# EAGLE design HoneyPI_Platine 2.0 (EAGLE 9.6.1)
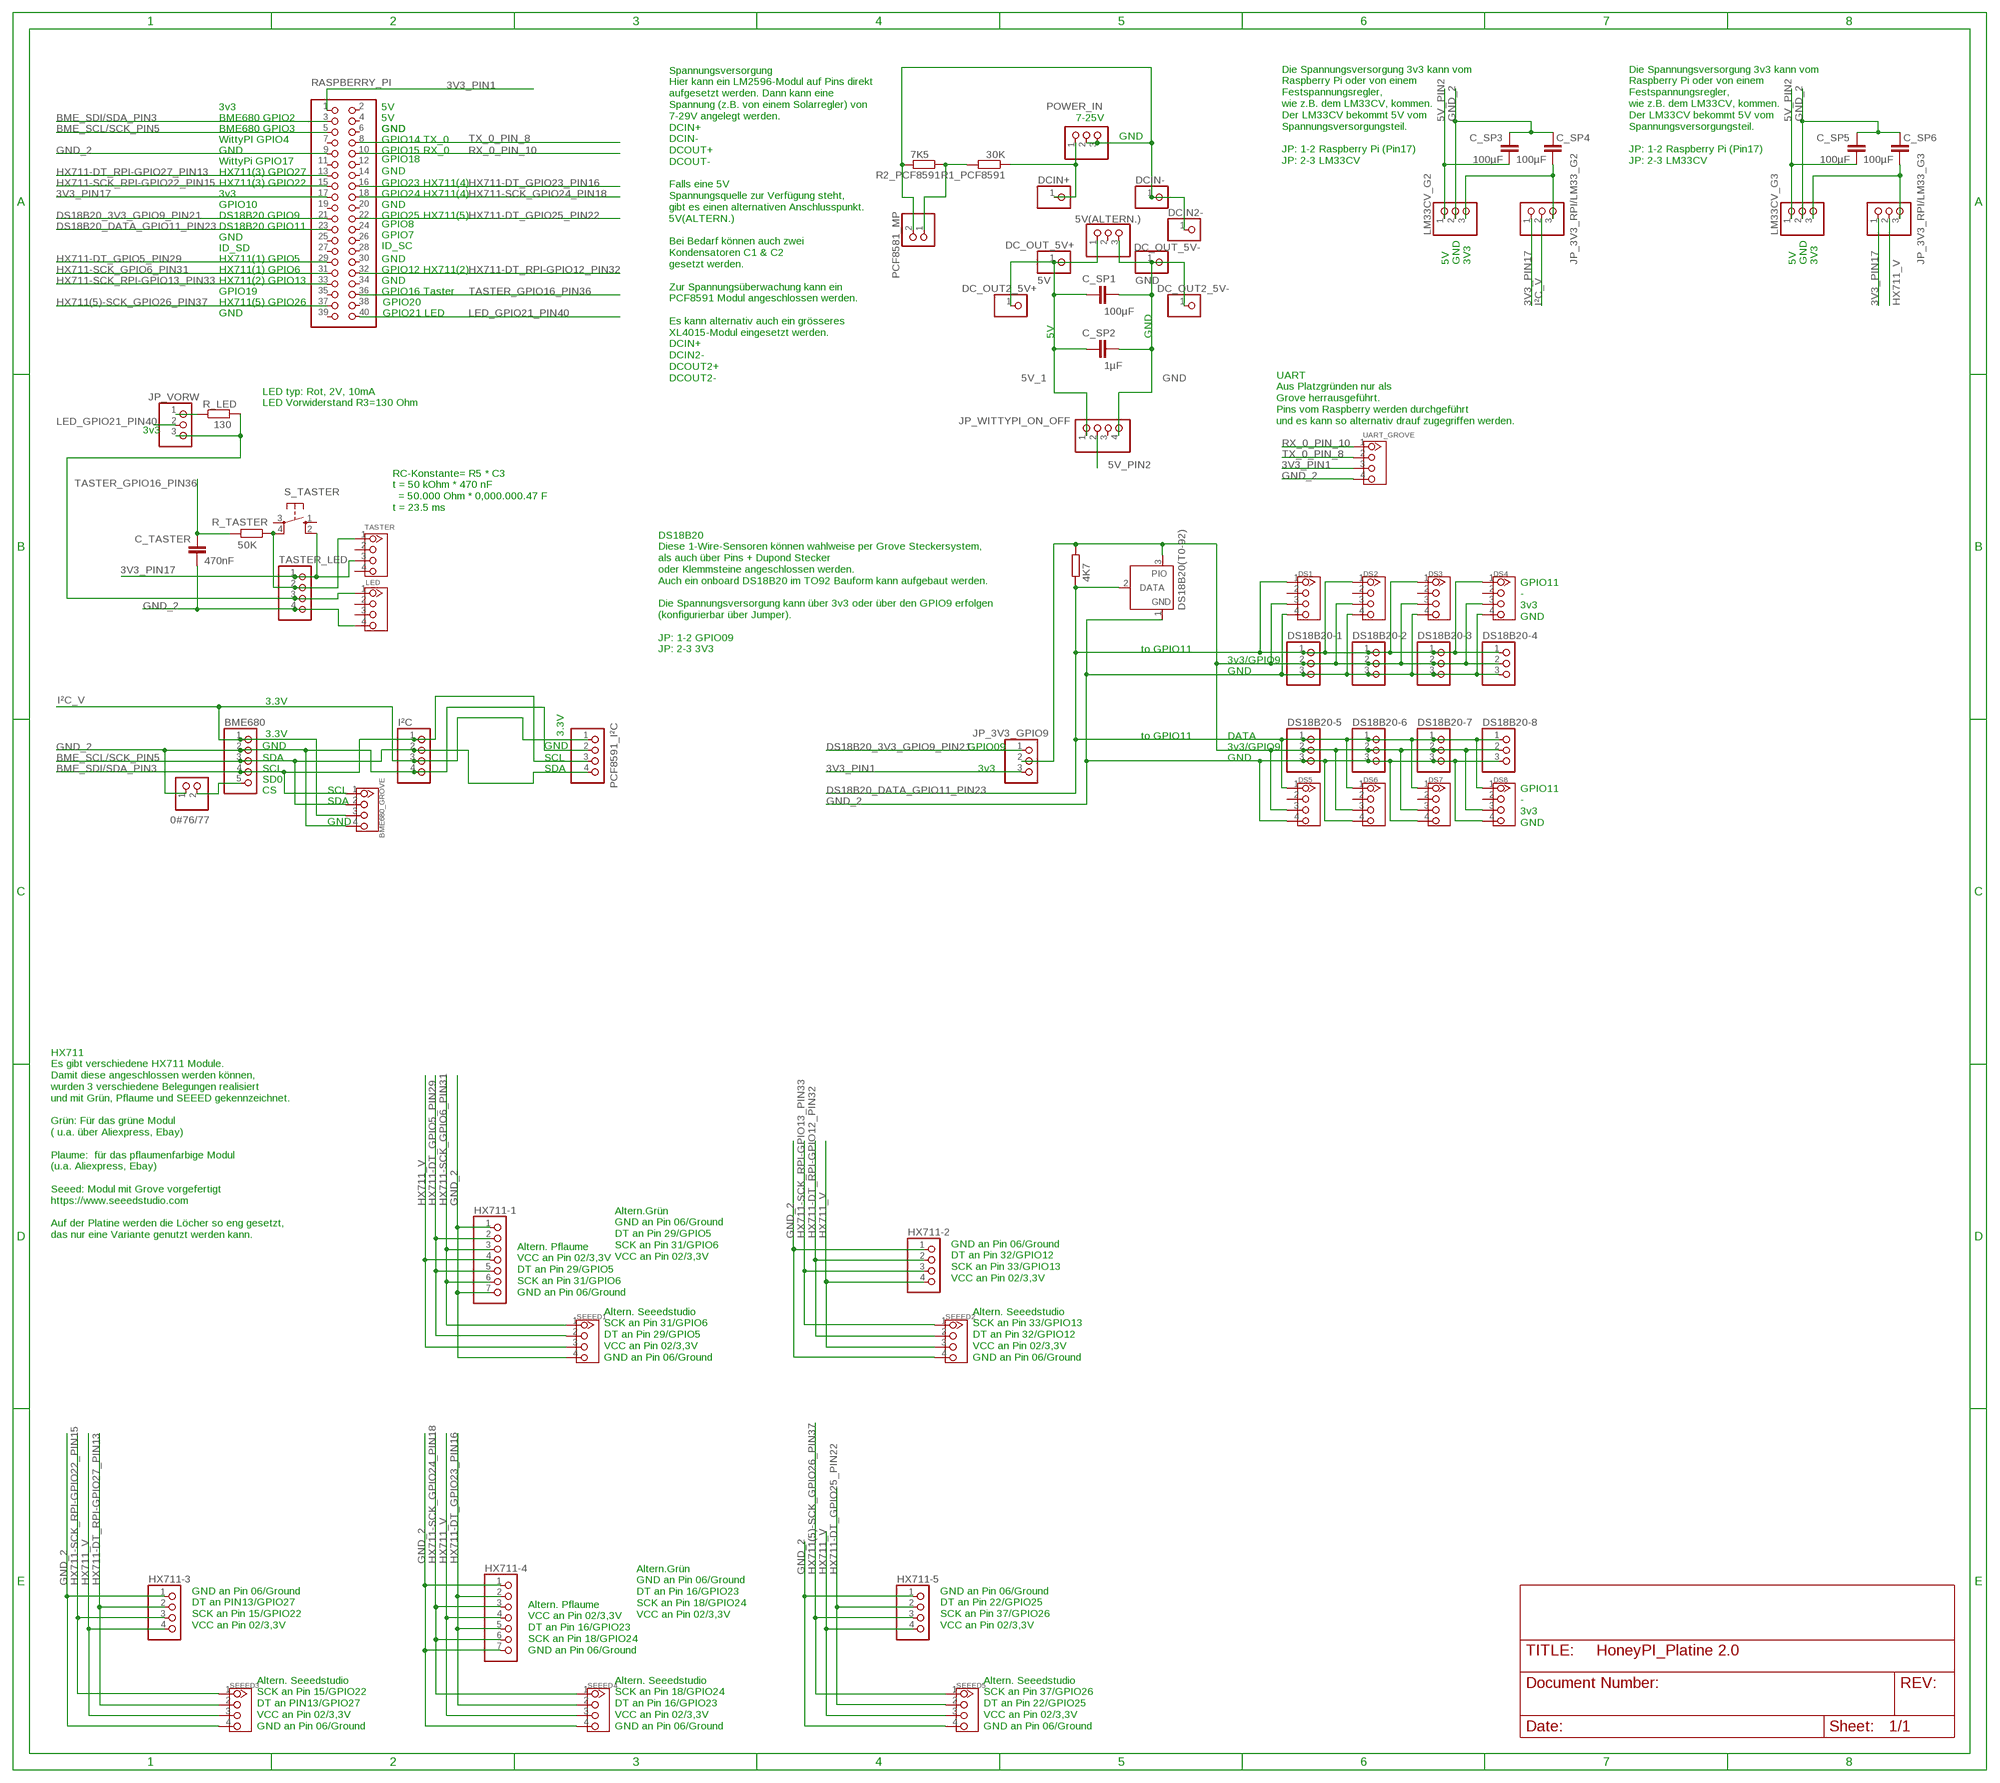
[diagram p0: schematic, sheet 1]

## Parts
0#76/77  PINHD-1X2  [1X02]
5V(ALTERN.)  PINHD-1X3  [1X03]
BME680  PINHD-1X5  [1X05]
BME680_GROVE  TWIG-4P-2.0-2.0  [4P-2.0]
C_SP1  100µF  C2,5-3  [C2.5-3]
C_SP2  1µF  C2,5-3  [C2.5-3]
C_SP3  100µF  C2,5-3  [C2.5-3]
C_SP4  100µF  C2,5-3  [C2.5-3]
C_SP5  100µF  C2,5-3  [C2.5-3]
C_SP6  100µF  C2,5-3  [C2.5-3]
C_TASTER  470nF  C2,5-3  [C2.5-3]
DC_OUT2_5V+  PINHD-1X1  [1X01]
DC_OUT2_5V-  PINHD-1X1  [1X01]
DC_OUT_5V+  5V  PINHD-1X1  [1X01]
DC_OUT_5V-  GND  PINHD-1X1  [1X01]
DCIN2-  PINHD-1X1  [1X01]
DCIN+  PINHD-1X1  [1X01]
DCIN-  PINHD-1X1  [1X01]
DS1  TWIG-4P-2.0-2.0  [4P-2.0]
DS2  TWIG-4P-2.0-2.0  [4P-2.0]
DS3  TWIG-4P-2.0-2.0  [4P-2.0]
DS4  TWIG-4P-2.0-2.0  [4P-2.0]
DS5  TWIG-4P-2.0-2.0  [4P-2.0]
DS6  TWIG-4P-2.0-2.0  [4P-2.0]
DS7  TWIG-4P-2.0-2.0  [4P-2.0]
DS8  TWIG-4P-2.0-2.0  [4P-2.0]
DS18B20(T0-92)  DS18b20  DS2405  [TO92-]
DS18B20-1  PINHD-1X3  [1X03]
DS18B20-2  PINHD-1X3  [1X03]
DS18B20-3  PINHD-1X3  [1X03]
DS18B20-4  PINHD-1X3  [1X03]
DS18B20-5  PINHD-1X3  [1X03]
DS18B20-6  PINHD-1X3  [1X03]
DS18B20-7  PINHD-1X3  [1X03]
DS18B20-8  PINHD-1X3  [1X03]
HX711-1  PINHD-1X7  [1X07]
HX711-2  PINHD-1X4  [1X04]
HX711-3  PINHD-1X4  [1X04]
HX711-4  PINHD-1X7  [1X07]
HX711-5  PINHD-1X4  [1X04]
I²C  PINHD-1X4  [1X04]
JP_3V3_GPIO9  PINHD-1X3  [1X03]
JP_3V3_RPI/LM33_G2  PINHD-1X3  [1X03]
JP_3V3_RPI/LM33_G3  PINHD-1X3  [1X03]
JP_VORW  PINHD-1X3  [1X03]
JP_WITTYPI_ON_OFF  PINHD-1X4  [1X04]
LED  TWIG-4P-2.0-2.0  [4P-2.0]
LM33CV_G2  PINHD-1X3  [1X03]
LM33CV_G3  PINHD-1X3  [1X03]
PCF8581_MP  PINHD-1X2  [1X02]
PCF8591_I²C  PINHD-1X4  [1X04]
POWER_IN  PINHD-1X3  [1X03]
R1_PCF8591  30K  R-EU_0204/7  [0204/7]
R2_PCF8591  7K5  R-EU_0204/7  [0204/7]
R_DS18B20  4K7  R-EU_0204/7  [0204/7]
R_LED  130  R-EU_0204/7  [0204/7]
R_TASTER  50K  R-EU_0204/7  [0204/7]
RASPBERRY_PI  PINHD-2X20  [2X20]
S_TASTER  10-XX  [B3F-10XX]
SEEED1  TWIG-4P-2.0-2.0  [4P-2.0]
SEEED2  TWIG-4P-2.0-2.0  [4P-2.0]
SEEED3  TWIG-4P-2.0-2.0  [4P-2.0]
SEEED4  TWIG-4P-2.0-2.0  [4P-2.0]
SEEED5  TWIG-4P-2.0-2.0  [4P-2.0]
TASTER  TWIG-4P-2.0-2.0  [4P-2.0]
TASTER_LED  PINHD-1X4  [1X04]
UART_GROVE  TWIG-4P-2.0-2.0  [4P-2.0]

## Nets
3V3 [Supply3v3]: DS1.3 DS2.3 DS3.3 DS4.3 DS5.3 DS6.3 DS7.3 DS8.3 DS18B20(T0-92).3(PIO) DS18B20-1.2 DS18B20-2.2 DS18B20-3.2 DS18B20-4.2 DS18B20-5.2 DS18B20-6.2 DS18B20-7.2 DS18B20-8.2 JP_3V3_GPIO9.2 R_DS18B20.2
3V3_PIN1 [Supply3v3]: JP_3V3_GPIO9.3 RASPBERRY_PI.1 UART_GROVE.3
3V3_PIN17 [Supply3v3]: JP_3V3_RPI/LM33_G2.1 JP_3V3_RPI/LM33_G3.1 RASPBERRY_PI.17 S_TASTER.2(S1) TASTER.3 TASTER_LED.1
5V_1 [Supply5v]: 5V(ALTERN.).1 C_SP1.1 C_SP2.1 DC_OUT2_5V+.1 DC_OUT_5V+.1 JP_WITTYPI_ON_OFF.1
5V_PIN2 [Supply5v]: C_SP3.1 C_SP5.1 JP_WITTYPI_ON_OFF.2 LM33CV_G2.1 LM33CV_G3.1
BME_SCL/SCK_PIN5: BME680.3 BME680_GROVE.2 I²C.2 PCF8591_I²C.4 RASPBERRY_PI.5
BME_SDI/SDA_PIN3: BME680.4 BME680_GROVE.1 I²C.1 PCF8591_I²C.3 RASPBERRY_PI.3
DS18B20_3V3_GPIO9_PIN21 [Supply3v3]: JP_3V3_GPIO9.1 RASPBERRY_PI.21
DS18B20_DATA_GPIO11_PIN23: DS1.1 DS2.1 DS3.1 DS4.1 DS5.1 DS6.1 DS7.1 DS8.1 DS18B20(T0-92).2(DATA) DS18B20-1.1 DS18B20-2.1 DS18B20-3.1 DS18B20-4.1 DS18B20-5.1 DS18B20-6.1 DS18B20-7.1 DS18B20-8.1 R_DS18B20.1 RASPBERRY_PI.23
GND [Supply3v3]: 5V(ALTERN.).3 C_SP1.2 C_SP2.2 DC_OUT2_5V-.1 DC_OUT_5V-.1 JP_WITTYPI_ON_OFF.4
GND_2 [Supply3v3]: 0#76/77.1 BME680.2 BME680_GROVE.4 C_SP3.2 C_SP4.2 C_SP5.2 C_SP6.2 C_TASTER.1 DS1.4 DS2.4 DS3.4 DS4.4 DS5.4 DS6.4 DS7.4 DS8.4 DS18B20(T0-92).1(GND) DS18B20-1.3 DS18B20-2.3 DS18B20-3.3 DS18B20-4.3 DS18B20-5.3 DS18B20-6.3 DS18B20-7.3 DS18B20-8.3 HX711-1.1 HX711-1.7 HX711-2.1 HX711-3.1 HX711-4.1 HX711-4.7 HX711-5.1 I²C.4 LED.4 LM33CV_G2.2 LM33CV_G3.2 PCF8591_I²C.2 RASPBERRY_PI.9 SEEED1.4 SEEED2.4 SEEED3.4 SEEED4.4 SEEED5.4 TASTER_LED.4 UART_GROVE.4
HX711(5)-SCK_GPIO26_PIN37: HX711-5.3 RASPBERRY_PI.37 SEEED5.1
HX711-DT_GPIO5_PIN29: HX711-1.2 HX711-1.5 RASPBERRY_PI.29 SEEED1.2
HX711-DT_GPIO23_PIN16: HX711-4.2 HX711-4.5 RASPBERRY_PI.16 SEEED4.2
HX711-DT_GPIO25_PIN22: HX711-5.2 RASPBERRY_PI.22 SEEED5.2
HX711-DT_RPI-GPIO12_PIN32: HX711-2.2 RASPBERRY_PI.32 SEEED2.2
HX711-DT_RPI-GPIO27_PIN13: HX711-3.2 RASPBERRY_PI.13 SEEED3.2
HX711-SCK_GPIO6_PIN31: HX711-1.3 HX711-1.6 RASPBERRY_PI.31 SEEED1.1
HX711-SCK_GPIO24_PIN18: HX711-4.3 HX711-4.6 RASPBERRY_PI.18 SEEED4.1
HX711-SCK_RPI-GPIO13_PIN33: HX711-2.3 RASPBERRY_PI.33 SEEED2.1
HX711-SCK_RPI-GPIO22_PIN15: HX711-3.3 RASPBERRY_PI.15 SEEED3.1
HX711_V [Supply5v]: HX711-1.4 HX711-2.4 HX711-3.4 HX711-4.4 HX711-5.4 JP_3V3_RPI/LM33_G3.2 SEEED1.3 SEEED2.3 SEEED3.3 SEEED4.3 SEEED5.3
I²C_V [Supply3v3]: BME680.1 BME680_GROVE.3 I²C.3 JP_3V3_RPI/LM33_G2.2 PCF8591_I²C.1
LED_2: JP_VORW.3 LED.1 R_LED.2 TASTER_LED.3
LED_GPIO21_PIN40 [Supply3v3]: JP_VORW.2 RASPBERRY_PI.40
N$1: DCIN2-.1 DCIN-.1 PCF8581_MP.2 POWER_IN.2 POWER_IN.3 R2_PCF8591.2
N$2: C_SP4.1 JP_3V3_RPI/LM33_G2.3 LM33CV_G2.3
N$3: R_TASTER.1 S_TASTER.4(P1) TASTER.1 TASTER_LED.2
N$4: C_SP6.1 JP_3V3_RPI/LM33_G3.3 LM33CV_G3.3
N$6: PCF8581_MP.1 R1_PCF8591.2 R2_PCF8591.1
N$8: 0#76/77.2 BME680.5
N$10: JP_VORW.1 R_LED.1
N$45 [Supply5v]: DCIN+.1 POWER_IN.1 R1_PCF8591.1
RX_0_PIN_10: RASPBERRY_PI.10 UART_GROVE.1
TASTER_GPIO16_PIN36: C_TASTER.2 R_TASTER.2 RASPBERRY_PI.36
TX_0_PIN_8: RASPBERRY_PI.8 UART_GROVE.2
Unconnected: 5V(ALTERN.).2 DS1.2 DS2.2 DS3.2 DS4.2 DS5.2 DS6.2 DS7.2 DS8.2 JP_WITTYPI_ON_OFF.3 LED.2 LED.3 RASPBERRY_PI.2 RASPBERRY_PI.4 RASPBERRY_PI.6 RASPBERRY_PI.7 RASPBERRY_PI.11 RASPBERRY_PI.12 RASPBERRY_PI.14 RASPBERRY_PI.19 RASPBERRY_PI.20 RASPBERRY_PI.24 RASPBERRY_PI.25 RASPBERRY_PI.26 RASPBERRY_PI.27 RASPBERRY_PI.28 RASPBERRY_PI.30 RASPBERRY_PI.34 RASPBERRY_PI.35 RASPBERRY_PI.38 RASPBERRY_PI.39 S_TASTER.1(S) S_TASTER.3(P) TASTER.2 TASTER.4

## Notes on the sheet
- 3v3 | 5V
- BME680 GPIO2 | 5V | 7-25V
- BME680 GPIO3 | GND | GND
- GND
- WittyPI GPIO4 | GPIO14 TX_0
- GND | GPIO15 RX_0
- WittyPi GPIO17 | GPIO18
- HX711(3) GPIO27 | GND
- Die Spannungsversorgung 3v3 kann vom
  Raspberry Pi oder von einem 
  Festspannungsregler, 
  wie z.B. dem LM33CV, kommen.
  Der LM33CV bekommt 5V vom
  Spannungsversorgungsteil.
  
  JP: 1-2 Raspberry Pi (Pin17)
  JP: 2-3 LM33CV
- Die Spannungsversorgung 3v3 kann vom
  Raspberry Pi oder von einem 
  Festspannungsregler, 
  wie z.B. dem LM33CV, kommen.
  Der LM33CV bekommt 5V vom
  Spannungsversorgungsteil.
  
  JP: 1-2 Raspberry Pi (Pin17)
  JP: 2-3 LM33CV
- HX711(3) GPIO22 | GPIO23 HX711(4)
- 3v3 | GPIO24 HX711(4)
- GPIO10 | GND
- DS18B20 GPIO9 | GPIO25 HX711(5)
- DS18B20 GPIO11 | GPIO8
- GND | GPIO7
- ID_SD | ID_SC
- HX711(1) GPIO5 | GND | 5V | GND | 3V3 | 5V | GND | 3V3
- HX711(1) GPIO6 | GPIO12 HX711(2)
- HX711(2) GPIO13 | GND
- GPIO19 | GPIO16 Taster
- HX711(5) GPIO26 | GPIO20
- GND | GPIO21 LED
- 5V | GND
- Spannungsversorgung
  Hier kann ein LM2596-Modul auf Pins direkt
  aufgesetzt werden. Dann kann eine
  Spannung (z.B. von einem Solarregler) von
  7-29V angelegt werden.
  DCIN+
  DCIN-
  DCOUT+
  DCOUT-
  
  Falls eine 5V
  Spannungsquelle zur Verfügung steht,
  gibt es einen alternativen Anschlusspunkt.
  5V(ALTERN.)
  
  Bei Bedarf können auch zwei
  Kondensatoren C1 & C2
  gesetzt werden.    
  
  Zur Spannungsüberwachung kann ein
  PCF8591 Modul angeschlossen werden. 
  
  Es kann alternativ auch ein grösseres
  XL4015-Modul eingesetzt werden. 
  DCIN+
  DCIN2-
  DCOUT2+
  DCOUT2-
- LED typ: Rot, 2V, 10mA
  LED Vorwiderstand R3=130 Ohm
- 3v3
- UART
  Aus Platzgründen nur als
  Grove herrausgeführt. 
  Pins vom Raspberry werden durchgeführt
  und es kann so alternativ drauf zugegriffen werden.
- RC-Konstante= R5 * C3
  t = 50 kOhm * 470 nF    
    = 50.000 Ohm * 0,000.000.47 F
  t = 23.5 ms
- GPIO11
  -
  3v3
  GND
- DS18B20
  Diese 1-Wire-Sensoren können wahlweise per Grove Steckersystem,
  als auch über Pins + Dupond Stecker
  oder Klemmsteine angeschlossen werden.
  Auch ein onboard DS18B20 im TO92 Bauform kann aufgebaut werden. 
  
  Die Spannungsversorgung kann über 3v3 oder über den GPIO9 erfolgen
  (konfigurierbar über Jumper).
  
  JP: 1-2 GPIO09
  JP: 2-3 3V3
- to GPIO11
- 3v3/GPIO9
- GND
- 3.3V
- 3.3V | 3.3V
- to GPIO11 | DATA
- GND | GND | GPIO09 | 3v3/GPIO9
- SDA | SCL | GND
- SCL | SDA | 3v3
- SD0
- CS | SCL
- SDA
- GND
- GPIO11
  -
  3v3
  GND
- HX711
  Es gibt verschiedene HX711 Module.
  Damit diese angeschlossen werden können,
  wurden 3 verschiedene Belegungen realisiert
  und mit Grün, Pflaume und SEEED gekennzeichnet.
  
  Grün: Für das grüne Modul 
  ( u.a. über Aliexpress, Ebay)
  
  Plaume:  für das pflaumenfarbige Modul 
  (u.a. Aliexpress, Ebay) 
  
  Seeed: Modul mit Grove vorgefertigt
  https://www.seeedstudio.com
  
  Auf der Platine werden die Löcher so eng gesetzt,
  das nur eine Variante genutzt werden kann.
- Altern.Grün
  GND an Pin 06/Ground
  DT an Pin 29/GPIO5
  SCK an Pin 31/GPIO6
  VCC an Pin 02/3,3V
- GND an Pin 06/Ground
  DT an Pin 32/GPIO12
  SCK an Pin 33/GPIO13
  VCC an Pin 02/3,3V
- Altern. Pflaume
  VCC an Pin 02/3,3V
  DT an Pin 29/GPIO5
  SCK an Pin 31/GPIO6
  GND an Pin 06/Ground
- Altern. Seeedstudio
  SCK an Pin 31/GPIO6
  DT an Pin 29/GPIO5
  VCC an Pin 02/3,3V
  GND an Pin 06/Ground
- Altern. Seeedstudio
  SCK an Pin 33/GPIO13
  DT an Pin 32/GPIO12
  VCC an Pin 02/3,3V
  GND an Pin 06/Ground
- Altern.Grün
  GND an Pin 06/Ground
  DT an Pin 16/GPIO23
  SCK an Pin 18/GPIO24
  VCC an Pin 02/3,3V
- GND an Pin 06/Ground
  DT an PIN13/GPIO27
  SCK an Pin 15/GPIO22
  VCC an Pin 02/3,3V
- GND an Pin 06/Ground
  DT an Pin 22/GPIO25
  SCK an Pin 37/GPIO26
  VCC an Pin 02/3,3V
- Altern. Pflaume
  VCC an Pin 02/3,3V
  DT an Pin 16/GPIO23
  SCK an Pin 18/GPIO24
  GND an Pin 06/Ground
- Altern. Seeedstudio
  SCK an Pin 15/GPIO22
  DT an PIN13/GPIO27
  VCC an Pin 02/3,3V
  GND an Pin 06/Ground
- Altern. Seeedstudio
  SCK an Pin 18/GPIO24
  DT an Pin 16/GPIO23
  VCC an Pin 02/3,3V
  GND an Pin 06/Ground
- Altern. Seeedstudio
  SCK an Pin 37/GPIO26
  DT an Pin 22/GPIO25
  VCC an Pin 02/3,3V
  GND an Pin 06/Ground

## Library data of the parts
0#76/77 PCF8581_MP = pinhead:PINHD-1X2: PIN HEADER
5V(ALTERN.) DS18B20-1-DS18B20-8 JP_3V3_GPIO9 JP_3V3_RPI/LM33_G2 JP_3V3_RPI/LM33_G3 JP_VORW LM33CV_G2 LM33CV_G3 POWER_IN = pinhead:PINHD-1X3: PIN HEADER
BME680 = pinhead:PINHD-1X5: PIN HEADER
BME680_GROVE DS1-DS8 LED SEEED1-SEEED5 TASTER UART_GROVE = Connector:TWIG-4P-2.0
C_SP1-C_SP6 C_TASTER = capacitor-wima:C: CAPACITOR naming: grid - package width
DC_OUT2_5V+ DC_OUT2_5V- DC_OUT_5V+ DC_OUT_5V- DCIN2- DCIN+ DCIN- = pinhead:PINHD-1X1: PIN HEADER
DS18B20(T0-92) = maxim:DS2405: Addressable Switch DALLAS Semiconductor; MF: DALLAS SEMICONDUCTOR; MPN: DS2405; OC_FARNELL: 1188025; OC_NEWARK: 06F4645
HX711-1 HX711-4 = pinhead:PINHD-1X7: PIN HEADER
HX711-2 HX711-3 HX711-5 I²C JP_WITTYPI_ON_OFF PCF8591_I²C TASTER_LED = pinhead:PINHD-1X4: PIN HEADER
R1_PCF8591 R2_PCF8591 R_DS18B20 R_LED R_TASTER = rcl:R-EU_: RESISTOR, European symbol; SPICEPREFIX: R
RASPBERRY_PI = pinhead:PINHD-2X20: PIN HEADER
S_TASTER = switch-omron:10-XX: OMRON SWITCH; MPN: B3F-1000; OC_FARNELL: 176432; OC_NEWARK: 36M3542

## Net classes
0 Signal: width 0.152 mm, clearance 0.305 mm
1 Supply3v3: width 0.203 mm, clearance 0.305 mm
2 Supply5v: width 0.406 mm, clearance 0.305 mm

## Board
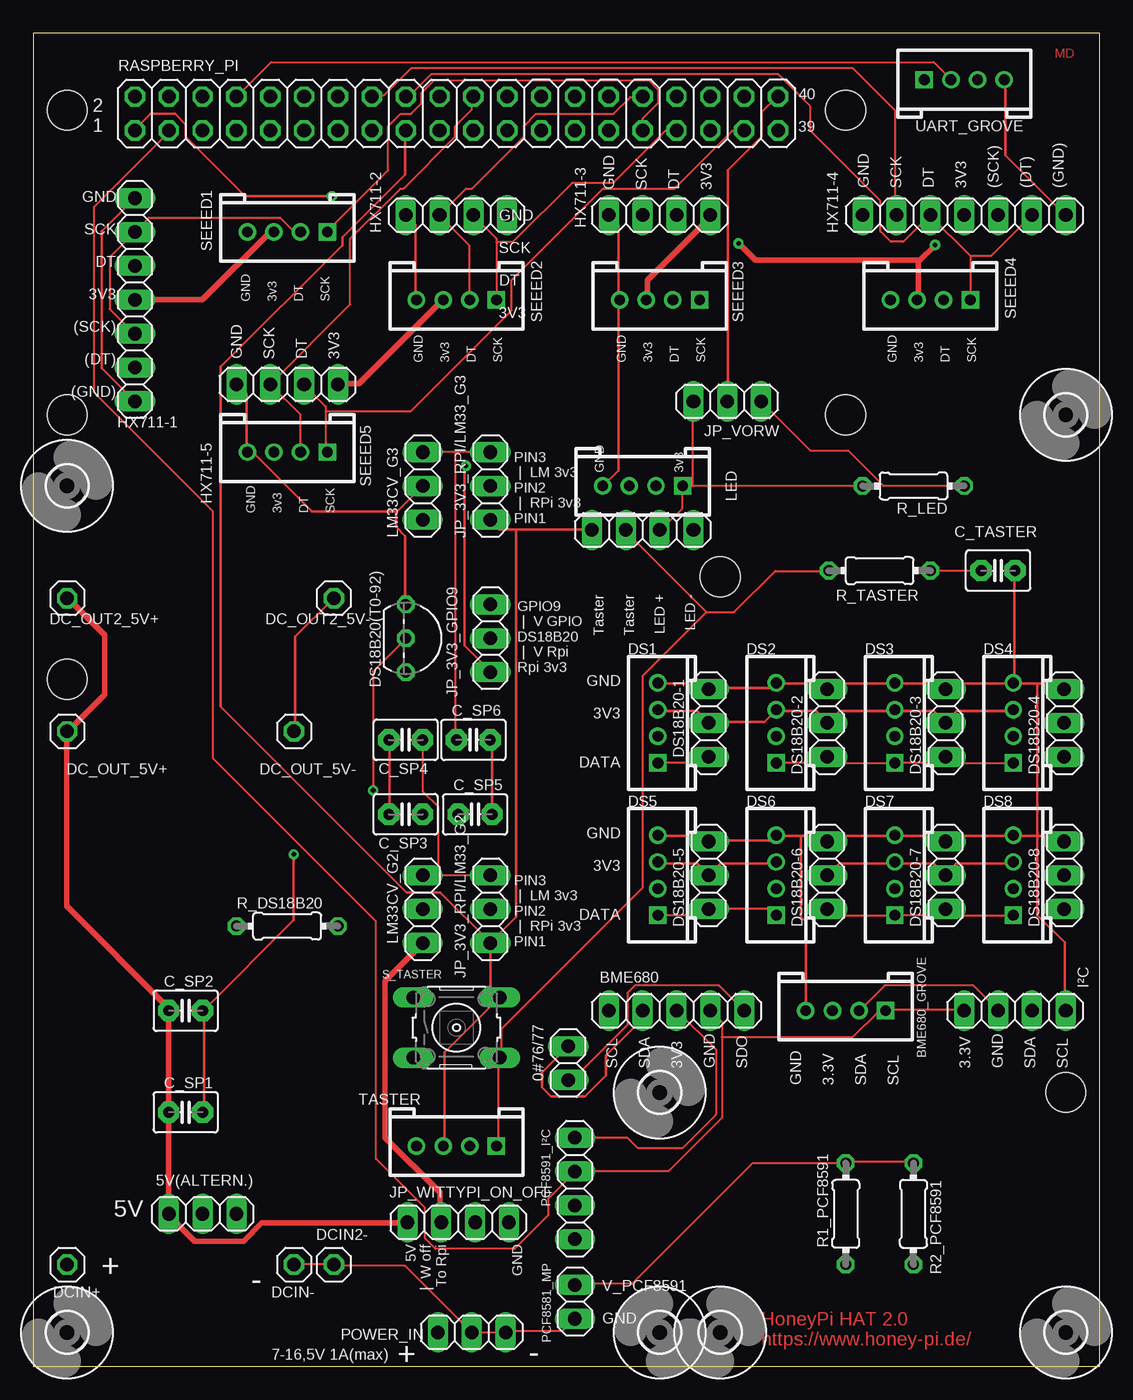
[diagram p1: board, top side]
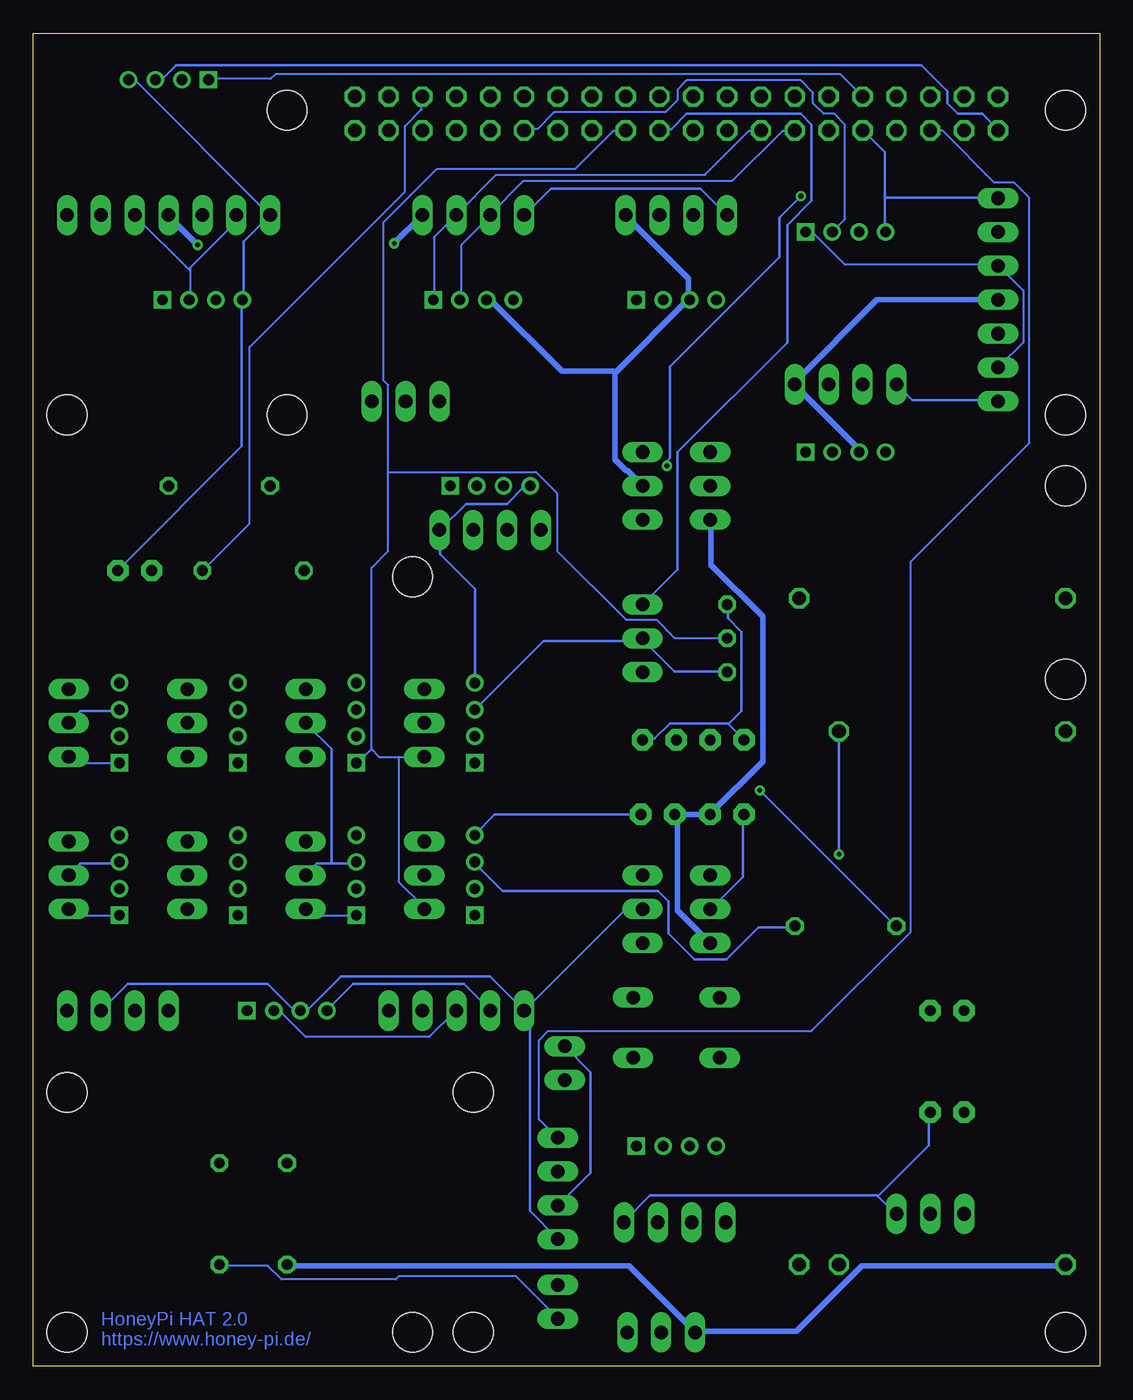
[diagram p2: board, bottom side, seen from below]

Size 80 x 100 mm. Coordinates in mm from the lower left corner, seen from the top.
Outline: 0,0 80,0 80,100 0,100 0,0
Copper layers (1*16): Top 0.035mm / dielectric 1.5mm / Bottom 0.035mm
Design rules "default *": minimum track width 6mil, minimum drill 0.35mm, track to track 6mil, track to pad 6mil, pad to pad 6mil, via to via 6mil, smd to smd 6mil, copper to edge 40mil, drill to drill 1mm, minimum pad ring 10mil, minimum via ring 8mil, stop-mask expansion 4mil, vias tented up to drill 0mil, thermal gap 10mil
Holes 3 mm at 2.54,94.23 2.54,71.37 60.96,94.23 60.96,71.37 77.47,20.54 51.54,59.23 2.54,51.54

### Footprints (pad centres in the part's own frame; a part is rotated, then mirrored left to right if it is on the bottom)
1X02 = drill 1.016 long: 1 -1.27,0; 2 1.27,0
1X03 = drill 1.016 long: 1 -2.54,0; 2 0,0; 3 2.54,0
1X05 = drill 1.016 long: 1 -5.08,0; 2 -2.54,0; 3 0,0; 4 2.54,0; 5 5.08,0
4P-2.0 = drill 0.8 pad 1.27 square: 1 -3,0 | drill 0.8 pad 1.27: 2 -1,0; 3 1,0; 4 3,0
C2.5-3 = drill 0.813 pad 1.6 octagon: 1 -1.27,0; 2 1.27,0
1X01 = drill 1.016 octagon: 1 0,0
TO92- = drill 0.813 octagon: 1 -2.54,0; 2 0,0; 3 2.54,0
1X07 = drill 1.016 long: 1 -7.62,0; 2 -5.08,0; 3 -2.54,0; 4 0,0; 5 2.54,0; 6 5.08,0; 7 7.62,0
1X04 = drill 1.016 long: 1 -3.81,0; 2 -1.27,0; 3 1.27,0; 4 3.81,0
0204/7 = drill 0.813 octagon: 1 -3.81,0; 2 3.81,0
2X20 = drill 1.016 octagon: 1 -24.13,-1.27; 2 -24.13,1.27; 3 -21.59,-1.27; 4 -21.59,1.27; 5 -19.05,-1.27; 6 -19.05,1.27; 7 -16.51,-1.27; 8 -16.51,1.27; 9 -13.97,-1.27; 10 -13.97,1.27; 11 -11.43,-1.27; 12 -11.43,1.27; 13 -8.89,-1.27; 14 -8.89,1.27; 15 -6.35,-1.27; 16 -6.35,1.27; 17 -3.81,-1.27; 18 -3.81,1.27; 19 -1.27,-1.27; 20 -1.27,1.27; 21 1.27,-1.27; 22 1.27,1.27; 23 3.81,-1.27; 24 3.81,1.27; 25 6.35,-1.27; 26 6.35,1.27; 27 8.89,-1.27; 28 8.89,1.27; 29 11.43,-1.27; 30 11.43,1.27; 31 13.97,-1.27; 32 13.97,1.27; 33 16.51,-1.27; 34 16.51,1.27; 35 19.05,-1.27; 36 19.05,1.27; 37 21.59,-1.27; 38 21.59,1.27; 39 24.13,-1.27; 40 24.13,1.27
B3F-10XX = drill 1.016 long: 1 -3.251,2.261; 2 3.251,2.261; 3 -3.251,-2.261; 4 3.251,-2.261
3,0 = hole 3: 0,0

### Placement (x,y rotation side)
0#76/77  40.13,22.73 270 top
5V(ALTERN.)  12.7,11.43 0 top
BME680  48.26,26.67 0 top
BME680_GROVE  60.96,26.67 180 top
C_SP1  11.43,19.05 0 top
C_SP2  11.43,26.67 0 top
C_SP3  27.94,41.4 180 top
C_SP4  27.94,46.99 180 top
C_SP5  33.15,41.4 0 top
C_SP6  33.02,46.99 0 top
C_TASTER  72.39,59.69 180 top
DC_OUT2_5V+  2.54,57.62 0 top
DC_OUT2_5V-  22.54,57.62 0 top
DC_OUT_5V+  2.54,47.62 0 top
DC_OUT_5V-  19.56,47.62 0 top
DCIN2-  22.54,7.62 0 top
DCIN+  2.54,7.62 0 top
DCIN-  19.56,7.62 0 top
DS1  46.86,48.26 90 top
DS2  55.75,48.26 90 top
DS3  64.64,48.26 90 top
DS4  73.53,48.26 90 top
DS5  46.86,36.83 90 top
DS6  55.75,36.83 90 top
DS7  64.64,36.83 90 top
DS8  73.53,36.83 90 top
DS18B20(T0-92)  27.94,54.61 270 top
DS18B20-1  50.67,48.26 90 top
DS18B20-2  59.56,48.26 90 top
DS18B20-3  68.45,48.26 90 top
DS18B20-4  77.34,48.26 90 top
DS18B20-5  50.67,36.83 90 top
DS18B20-6  59.56,36.83 90 top
DS18B20-7  68.45,36.83 90 top
DS18B20-8  77.34,36.83 90 top
HX711-1  7.62,80.01 270 top
HX711-2  31.75,86.36 0 top
HX711-3  46.99,86.36 0 top
HX711-4  69.85,86.36 0 top
HX711-5  19.05,73.66 0 top
I²C  73.66,26.67 0 top
JP_3V3_GPIO9  34.29,54.61 270 top
JP_3V3_RPI/LM33_G2  34.29,34.29 90 top
JP_3V3_RPI/LM33_G3  34.29,66.04 90 top
JP_VORW  52.07,72.39 180 top
JP_WITTYPI_ON_OFF  31.88,10.79 0 top
LED  45.72,66.04 180 top
LM33CV_G2  29.21,34.29 90 top
LM33CV_G3  29.21,66.04 90 top
PCF8581_MP  40.64,4.83 270 top
PCF8591_I²C  40.64,13.34 90 top
POWER_IN  32.89,2.54 0 top
R1_PCF8591  60.96,11.43 90 top
R2_PCF8591  66.04,11.43 270 top
R_DS18B20  19.05,33.02 0 top
R_LED  66.04,66.04 180 top
R_TASTER  63.5,59.69 0 top
RASPBERRY_PI  31.75,93.98 0 top
S_TASTER  31.75,25.4 0 top
SEEED1  19.05,85.09 180 top
SEEED2  31.75,80.01 180 top
SEEED3  46.99,80.01 180 top
SEEED4  67.31,80.01 180 top
SEEED5  19.05,68.58 180 top
TASTER  31.75,16.51 180 top
TASTER_LED  45.72,62.74 0 top
U$1  [3,0]  77.47,71.37 0 top
U$2  [3,0]  51.54,2.54 0 top
U$3  [3,0]  77.47,2.54 0 top
U$4  [3,0]  2.54,2.54 0 top
U$5  [3,0]  46.99,20.54 0 top
U$6  [3,0]  46.99,2.54 270 top
U$8  [3,0]  2.54,66.04 0 top
UART_GROVE  69.85,96.52 0 top

### Tracks (layer width: path | path; a pad name or v marks a point on that pad's centre or on a via)
3V3
  Top 0.203: DS1.3 46.86,49.15 49.84,49.15 50.63,48.35 DS18B20-1.2 50.75,48.35 54.86,48.35 55.66,49.15 DS2.3 55.78,49.15 58.75,49.15 59.55,48.35 DS18B20-2.2 59.66,48.35 60.47,49.15 64.58,49.15 DS3.3 64.69,49.15 67.55,49.15 68.35,48.35 DS18B20-3.2 68.47,48.35 69.27,49.15 73.5,49.15 DS4.3 | DS5.3 46.86,37.72 49.84,37.72 50.63,36.92 DS18B20-5.2 50.75,36.92 51.55,37.72 55.66,37.72 DS6.3 | DS18B20-6.2 59.66,36.92 60.47,37.72 64.58,37.72 DS7.3 64.69,37.72 67.55,37.72 68.35,36.92 DS18B20-7.2 68.47,36.92 69.27,37.72 73.5,37.72 DS8.3
  Bottom 0.203: DS18B20(T0-92).3 28,52.12 31.89,52.12 34.29,54.52 JP_3V3_GPIO9.2 34.29,54.41 41.72,54.41 DS1.3 | DS4.3 73.61,49.15 76.47,49.15 77.27,48.35 DS18B20-4.2 | DS8.3 73.61,37.72 76.47,37.72 77.27,36.92 DS18B20-8.2 | 57.61,37.72 58.75,37.72 59.55,36.92 DS18B20-6.2 | 57.61,37.72 55.78,37.72 DS6.3 | R_DS18B20.2 22.86,32.92 25.6,32.92 28,30.52 30.4,30.52 32.35,32.46 32.35,34.86 33.15,35.66 44.81,35.66 46.86,37.72 DS5.3 | 57.61,37.72 57.61,46.29 59.55,48.23 DS18B20-2.2
3V3_PIN1  (via drill 0.35)
  Top 0.203: v32.46,67.55 32.35,67.44 32.35,54.06 34.29,52.12 JP_3V3_GPIO9.3 | v22.4,87.78 15.89,87.78 11.43,92.24 11.43,93.15 10.63,93.95 8.8,93.95 7.66,92.81 RASPBERRY_PI.1
  Bottom 0.203: UART_GROVE.3 70.75,96.58 70.29,96.58 69.27,97.61 13.37,97.61 11.43,95.67 11.43,94.75 10.63,93.95 8.8,93.95 7.66,92.81 RASPBERRY_PI.1 | v32.46,67.55 32.46,67.89 32.23,68.12 32.23,74.98 24,83.21 24,86.18 v22.4,87.78
3V3_PIN17
  Top 0.203: 36.23,62.75 34.98,62.75 34.29,63.44 JP_3V3_RPI/LM33_G3.1 | 36.23,62.75 41.83,62.75 TASTER_LED.1 | TASTER.3 30.86,16.57 30.86,23.55 34.98,27.66 S_TASTER.2 34.86,27.66 34.29,28.23 JP_3V3_RPI/LM33_G2.1 34.29,31.77 | 34.29,31.77 30.52,35.55 28,35.55 14.06,49.49 14.06,74.98 23.2,84.12 23.2,84.7 27.89,89.38 27.89,92.7 RASPBERRY_PI.17 | 36.23,62.75 36.23,33.72 34.29,31.77
5V_1
  Top 0.406: DC_OUT2_5V+.1 2.63,57.61 5.37,54.86 5.37,50.41 2.63,47.66 DC_OUT_5V+.1 2.52,47.43 2.52,34.52 10.17,26.86 C_SP2.1 10.17,26.63 10.17,19.2 C_SP1.1 10.17,18.97 10.17,11.54 5V(ALTERN.).1 10.06,11.43 12.12,9.37 15.77,9.37 17.14,10.74 28,10.74 JP_WITTYPI_ON_OFF.1
5V_PIN2
  Top 0.406: JP_WITTYPI_ON_OFF.2 30.52,10.86 30.52,13.03 26.4,17.14 26.4,28.92 29.15,31.66 LM33CV_G2.1
  Bottom 0.406: LM33CV_G3.1 29.15,63.44 29.15,60.12 25.26,56.24 25.26,45.38 29.15,41.49 C_SP3.1 29.38,41.38 31.55,41.38 C_SP5.1 31.77,41.38 31.66,41.26 31.66,34.18 29.26,31.77 LM33CV_G2.1
BME_SCL/SCK_PIN5
  Top 0.152: BME680_GROVE.2 62.06,26.75 63.89,28.57 70.52,28.57 72.35,26.75 I²C.2 | PCF8591_I²C.4 44.58,17.14 45.38,16.34 48.69,16.34 51.21,18.86 51.21,23.77 48.35,26.63 BME680.3
  Bottom 0.152: RASPBERRY_PI.5 12.69,92.7 11.77,92.7 7.89,88.81 6.4,88.81 5.26,87.67 5.26,69.27 14.17,60.35 14.17,32.58 21.6,25.15 41.38,25.15 42.06,24.46 42.06,18.52 40.69,17.14 PCF8591_I²C.4 | BME680_GROVE.2 61.95,26.63 61.49,26.63 59.55,24.69 50.29,24.69 48.35,26.63 BME680.3
BME_SDI/SDA_PIN3
  Top 0.152: I²C.1 69.84,26.75 64.01,26.75 BME680_GROVE.1 63.89,26.63 63.44,26.63 61.49,24.69 51.66,24.69 | 51.66,24.69 51.66,25.83 50.86,26.63 BME680.4 | 51.66,24.69 51.66,18.63 47.66,14.63 40.69,14.63 PCF8591_I²C.3 40.58,14.52 38.63,12.57 38.63,11.32 36.12,8.8 30.18,8.8 29.38,9.6 29.38,11.89 25.72,15.54 25.72,33.38 13.49,45.61 13.49,64.12 4.57,73.04 4.57,86.98 10.06,92.47 10.06,92.7 RASPBERRY_PI.3
DS18B20_3V3_GPIO9_PIN21
  Bottom 0.203: JP_3V3_GPIO9.1 31.66,59.78 31.66,68.58 23.43,76.81 23.43,85.61 21.6,87.44 21.6,93.15 22.4,93.95 30.98,93.95 32.12,92.81 32.92,92.81 RASPBERRY_PI.21
DS18B20_DATA_GPIO11_PIN23  (via drill 0.35)
  Top 0.152: v25.49,43.2 25.49,52.12 27.89,54.52 DS18B20(T0-92).2 | DS5.1 50.18,33.83 50.63,34.29 DS18B20-5.1 55.21,34.29 55.66,33.83 DS6.1 | DS18B20-6.1 59.66,34.29 60.12,33.83 64.58,33.83 DS7.1 64.69,33.83 67.89,33.83 68.35,34.29 DS18B20-7.1 68.47,34.29 68.92,33.83 73.5,33.83 DS8.1 | DS1.1 50.18,45.26 50.63,45.72 DS18B20-1.1 | DS2.1 55.78,45.26 59.09,45.26 DS18B20-2.1 59.66,45.72 60.12,45.26 64.58,45.26 DS3.1 64.69,45.26 67.89,45.26 68.35,45.72 DS18B20-3.1 68.47,45.72 68.92,45.26 73.5,45.26 DS4.1
  Bottom 0.152: v25.49,43.2 15.32,33.03 R_DS18B20.1 | DS8.1 73.61,33.83 76.81,33.83 77.27,34.29 DS18B20-8.1 | DS6.1 55.78,33.83 59.09,33.83 DS18B20-6.1 | DS4.1 73.61,45.26 76.81,45.26 77.27,45.72 DS18B20-4.1 | 53.38,67.09 53.38,61.15 54.63,59.89 54.63,46.29 | 53.38,67.09 53.38,73.61 53.72,73.95 53.72,85.84 49.72,89.84 39.32,89.84 36.46,92.7 35.66,92.7 RASPBERRY_PI.23 | 54.63,46.29 55.66,45.26 DS2.1 | 52.58,45.72 54.06,45.72 54.63,46.29 | 52.58,45.72 DS18B20-1.1 | 52.58,45.72 52.58,36.35 50.75,34.52 50.75,34.29 DS18B20-5.1 | 53.38,67.09 42.29,67.09 40.69,65.49 40.69,61.15 35.55,56.01 33.26,56.01 31.89,54.63 28,54.63 DS18B20(T0-92).2
GND  (via drill 0.35)
  Top 0.203: DC_OUT_5V-.1 19.66,47.66 19.66,54.75 22.52,57.61 DC_OUT2_5V-.1 | C_SP1.2 12.8,19.09 12.8,26.63 C_SP2.2 12.8,26.75 19.55,33.49 v19.55,38.41
  Bottom 0.203: 16.63,12.74 15.32,11.43 5V(ALTERN.).3 | 16.63,12.74 16.69,12.8 33.72,12.8 35.66,10.86 JP_WITTYPI_ON_OFF.4 | 16.63,12.74 12.8,16.57 12.8,18.97 C_SP1.2 | v19.55,38.41 19.55,47.55 DC_OUT_5V-.1
GND_2
  Top 0.203: HX711-5.1 15.32,73.61 16,72.92 16,68.58 SEEED5.4 16.46,68.58 20.92,64.12 27.2,64.12 27.26,64.06 | 27.26,64.06 29.15,65.95 LM33CV_G3.2 | 27.26,64.06 27.2,64.01 27.2,62.98 27.89,62.29 27.89,57.15 DS18B20(T0-92).1 | C_SP5.2 34.4,41.49 34.4,46.86 34.29,46.98 C_SP6.2 | C_SP4.2 26.75,46.98 26.75,41.49 C_SP3.2 | HX711-1.1 5.14,85.15 5.14,74.87 HX711-1.7 | 75.32,39.78 76.92,39.78 77.27,39.43 DS18B20-8.3 | 75.32,39.78 73.61,39.78 DS8.4 73.5,39.78 68.81,39.78 68.47,39.43 DS18B20-7.3 68.35,39.43 68.01,39.78 64.69,39.78 DS7.4 64.58,39.78 60.01,39.78 59.66,39.43 DS18B20-6.3 59.55,39.43 59.21,39.78 57.61,39.78 | 75.32,39.78 75.32,33.83 77.38,31.77 77.38,26.75 I²C.4 | DS5.4 46.86,39.78 50.29,39.78 50.63,39.43 DS18B20-5.3 50.75,39.43 55.32,39.43 55.66,39.78 DS6.4 55.78,39.78 57.61,39.78 | 57.61,39.78 57.61,33.72 57.95,33.38 57.95,26.75 BME680_GROVE.4 | BME680.2 45.72,26.06 42.98,23.32 42.98,21.83 41.38,20.23 38.86,20.23 38.18,20.92 38.18,22.06 40.12,24 0#76/77.1 | UART_GROVE.4 72.92,96.47 72.92,90.87 77.38,86.41 HX711-4.7 | HX711-2.1 28.69,85.61 28.69,80.01 SEEED2.4 | 43.89,80.01 43.89,85.61 43.2,86.3 HX711-3.1 | 75.32,51.21 76.92,51.21 77.27,50.86 DS18B20-4.3 | 75.32,51.21 73.61,51.21 DS4.4 | C_TASTER.1 73.61,59.66 73.61,51.32 DS4.4 | DS1.4 46.86,51.21 50.29,51.21 50.63,50.86 DS18B20-1.3 50.75,50.86 55.32,50.86 55.66,51.21 DS2.4 55.78,51.21 59.21,51.21 59.55,50.86 DS18B20-2.3 59.66,50.86 60.01,51.21 64.58,51.21 DS3.4 64.69,51.21 68.01,51.21 68.35,50.86 DS18B20-3.3 68.47,50.86 68.81,51.21 73.5,51.21 DS4.4 | 43.89,80.01 43.89,67.21 42.75,66.06 LED.4
  Top 0.203: 43.89,80.01 SEEED3.4 | 75.32,51.21 75.32,39.78
  Bottom 0.203: 16.12,87.67 16.12,91.1 17.72,92.7 RASPBERRY_PI.9 | 16.12,87.67 16.12,85.15 SEEED1.4 | 16.12,87.67 7.66,87.67 HX711-1.1 | HX711-1.7 7.66,72.47 14.06,72.47 15.2,73.61 HX711-5.1 | LM33CV_G2.2 29.15,34.29 26.75,36.69 26.75,41.38 C_SP3.2 | 27.83,48.18 26.75,47.09 C_SP4.2 | 27.83,48.18 27.89,48.23 32.23,48.23 33.38,47.09 34.29,47.09 C_SP6.2 | 27.83,48.18 26.86,49.15 26.86,55.09 27.89,56.12 27.89,57.15 DS18B20(T0-92).1 | PCF8591_I²C.2 40.58,12.12 38.18,14.52 38.18,22.06 40.12,24 0#76/77.1 | BME680.2 45.72,26.75 47.66,28.69 56.01,28.69 57.95,26.75 BME680_GROVE.4 | UART_GROVE.4 72.81,96.47 72.35,96.47 62.29,86.41 HX711-4.1 64.24,84.35 64.24,80.01 SEEED4.4 64.35,80.01 64.35,69.04 73.61,59.78 C_TASTER.1 | HX711-2.1 28,86.41 29.95,88.35 41.15,88.35 43.09,86.41 HX711-3.1 | LED.4 42.75,65.95 43.2,65.95 44.46,64.69 47.55,64.69 49.49,62.75 TASTER_LED.4 49.49,62.64 49.49,60.92 46.86,58.29 DS1.4 | C_SP5.2 34.52,41.38 45.38,41.38 46.86,39.89 DS5.4
HX711(5)-SCK_GPIO26_PIN37
  Top 0.152: 21.95,71.67 21.95,72.01 20.34,73.61 HX711-5.3 | 21.95,71.67 21.95,68.58 SEEED5.1 | 21.95,71.67 28.35,71.67 35.89,79.21 35.89,81.5 42.75,88.35 48.12,88.35 52.46,92.7 53.26,92.7 RASPBERRY_PI.37
HX711-DT_GPIO5_PIN29
  Top 0.152: SEEED1.2 20,85.15 19.55,85.15 18.52,86.18 8.69,86.18 7.66,85.15 HX711-1.2 7.54,85.04 5.71,83.21 5.71,79.32 7.54,77.5 HX711-1.5
  Bottom 0.152: RASPBERRY_PI.29 43.09,92.81 42.18,92.81 40.92,94.07 32.58,94.07 31.66,94.98 31.66,95.78 30.98,96.47 22.4,96.47 21.49,95.56 21.49,94.75 20.69,93.95 19.89,93.95 19.09,93.15 19.09,86.07 20,85.15 SEEED1.2
HX711-DT_GPIO23_PIN16
  Top 0.152: RASPBERRY_PI.16 25.49,95.33 26.29,95.33 28.35,97.38 61.49,97.38 64.69,94.18 64.69,86.41 HX711-4.2
  Bottom 0.152: 68.24,82.18 68.24,82.41 64.81,85.84 64.81,86.3 HX711-4.2 | 68.24,82.18 68.24,80.01 SEEED4.2 | 68.24,82.18 72.35,86.3 HX711-4.5
HX711-DT_GPIO25_PIN22
  Top 0.152: SEEED5.2 20,68.58 20,71.44 HX711-5.2 17.83,73.72 23.77,79.67 23.77,84.58 27.55,88.35 27.77,88.35 31.66,92.24 31.66,93.04 32.92,94.3 32.92,95.21 RASPBERRY_PI.22
HX711-DT_RPI-GPIO12_PIN32
  Top 0.152: SEEED2.2 32.69,80.01 32.69,84.12 30.52,86.3 HX711-2.2 30.52,86.41 32.46,88.35 32.92,88.35 36.8,92.24 36.8,93.04 37.72,93.95 43.55,93.95 44.81,95.21 45.72,95.21 RASPBERRY_PI.32
HX711-DT_RPI-GPIO27_PIN13
  Bottom 0.152: SEEED3.2 47.89,80.01 47.89,84.12 45.72,86.3 HX711-3.2 45.72,86.41 43.2,88.92 27.55,88.92 23.77,92.7 22.86,92.7 RASPBERRY_PI.13
HX711-SCK_GPIO6_PIN31
  Top 0.152: RASPBERRY_PI.31 45.72,93.61 46.86,94.75 46.86,95.78 46.18,96.47 30.06,96.47 29.15,95.56 29.15,94.75 28.35,93.95 27.55,93.95 26.63,93.04 26.63,89.72 22.06,85.15 SEEED1.1
  Bottom 0.152: SEEED1.1 21.95,85.04 21.49,85.04 19.09,82.64 7.66,82.64 HX711-1.3 7.54,82.53 5.71,80.7 5.71,76.81 7.54,74.98 HX711-1.6
HX711-SCK_GPIO24_PIN18
  Top 0.152: 70.29,83.33 70.29,80.01 SEEED4.1 | 70.29,83.33 67.32,86.3 HX711-4.3 67.21,86.3 65.27,84.35 64.35,84.35 63.55,85.15 63.55,87.44 58.29,92.7 58.29,94.53 55.89,96.93 29.83,96.93 28.23,95.33 28,95.33 RASPBERRY_PI.18 | HX711-4.6 71.89,83.33 70.29,83.33
HX711-SCK_RPI-GPIO13_PIN33
  Top 0.152: 34.75,84.35 34.75,84.58 33.03,86.3 HX711-2.3 | 34.75,84.35 SEEED2.1 | 34.75,84.35 36.01,84.35 40.46,88.81 43.55,88.81 47.43,92.7 48.23,92.7 RASPBERRY_PI.33
HX711-SCK_RPI-GPIO22_PIN15
  Bottom 0.152: SEEED3.1 49.95,80.01 49.95,84.7 48.35,86.3 HX711-3.3 48.23,86.41 45.26,89.38 29.6,89.38 26.29,92.7 25.49,92.7 RASPBERRY_PI.15
HX711_V  (via drill 0.35)
  Top 0.406: 66.41,82.87 66.41,80.01 SEEED4.3 | v67.67,84.12 66.41,82.87 | SEEED3.3 46.06,80.01 46.06,81.5 50.86,86.3 HX711-3.4 | v52.92,84.24 54.18,82.98 66.29,82.98 66.41,82.87 | HX711-1.4 12.69,80.01 17.72,85.04 17.95,85.04 SEEED1.3 | HX711-5.4 22.86,73.72 24.46,73.72 SEEED2.3
  Bottom 0.406: v67.67,84.12 69.84,86.3 HX711-4.4 | HX711-3.4 v52.92,84.24 | SEEED5.3 18.06,68.81 22.86,73.61 HX711-5.4 22.86,73.84 16.69,80.01 HX711-1.4 | HX711-2.4 35.55,86.3 30.86,81.61 30.86,80.01 SEEED2.3 30.98,79.9 36.35,74.52 | 36.35,74.52 36.35,68.01 35.55,67.21 35.43,67.21 34.29,66.06 JP_3V3_RPI/LM33_G3.2 | SEEED3.3 45.72,80.01 40.35,74.64 36.46,74.64 36.35,74.52
I²C_V
  Bottom 0.203: I²C.3 74.87,26.75 72.92,28.69 62.41,28.69 60.47,26.75 60.01,26.75 BME680_GROVE.3 59.89,26.75 59.44,26.75 56.92,29.26 45.72,29.26 43.2,26.75 BME680.1 | JP_3V3_RPI/LM33_G2.2 35.55,34.29 43.09,26.75 BME680.1 | PCF8591_I²C.1 40.69,9.6 42.75,11.66 42.75,26.29 43.09,26.63 BME680.1
LED_2
  Top 0.152: TASTER_LED.3 47.09,62.75 48.69,64.35 48.69,65.95 LED.1 48.81,66.06 49.49,66.06 | 49.49,66.06 62.18,66.06 R_LED.2 | 49.49,66.06 49.49,72.35 JP_VORW.3
LED_GPIO21_PIN40
  Top 0.203: JP_VORW.2 52.12,72.47 52.12,89.72 54.63,92.24 54.63,94.07 55.78,95.21 RASPBERRY_PI.40
N$1
  Top 0.152: DCIN-.1 19.66,7.66 22.52,7.66 DCIN2-.1 22.63,7.54 27.89,7.54 POWER_IN.2 32.92,2.52 35.43,2.52 POWER_IN.3 35.43,2.63 39.66,2.63 40.58,3.54 PCF8581_MP.2
  Bottom 0.152: R2_PCF8591.2 65.95,7.54 62.41,7.54 61.38,6.51 52.81,6.51 52.58,6.74 43.78,6.74 40.69,3.66 PCF8581_MP.2
N$2
  Top 0.152: 30.4,36.8 34.29,36.8 JP_3V3_RPI/LM33_G2.3 | 30.4,36.8 29.26,36.8 LM33CV_G2.3 30.4,36.8 | 30.4,36.8 30.4,41.95 29.26,43.09 29.26,46.98 C_SP4.1
N$3
  Top 0.152: TASTER.1 34.86,16.57 34.86,22.97 34.98,23.09 S_TASTER.4 35.09,23.2 35.09,25.26 45.72,35.89 45.72,51.78 50.52,56.58 | 50.52,56.58 52.58,56.58 55.66,59.66 59.66,59.66 R_TASTER.1 | 50.52,56.58 44.46,62.64 TASTER_LED.2
N$4
  Top 0.152: JP_3V3_RPI/LM33_G3.3 31.66,68.58 | 31.66,68.58 LM33CV_G3.3 | 31.66,68.58 31.66,47.09 C_SP6.1
N$6
  Top 0.152: R2_PCF8591.1 65.95,15.32 61.04,15.32 R1_PCF8591.2 60.92,15.2 53.95,15.2 44.92,6.17 40.69,6.17 PCF8581_MP.1
N$8
  Top 0.152: BME680.5 51.44,28.57 45.15,28.57 44.58,28 44.58,25.6 40.46,21.49 40.23,21.49 0#76/77.2
N$10
  Top 0.152: R_LED.1 69.84,66.06 63.78,66.06 61.15,68.69 58.29,68.69 54.63,72.35 JP_VORW.1
N$45
  Bottom 0.406: R1_PCF8591.1 60.92,7.54 35.32,7.54 30.4,2.63 POWER_IN.1 30.18,2.63 22.75,2.63 17.83,7.54 2.63,7.54 DCIN+.1
RX_0_PIN_10
  Bottom 0.152: UART_GROVE.1 66.75,96.58 62.18,96.58 61.84,96.93 19.43,96.93 17.83,95.33 RASPBERRY_PI.10
TASTER_GPIO16_PIN36
  Top 0.152: R_TASTER.2 67.32,59.66 71.09,59.66 C_TASTER.2
  Bottom 0.152: RASPBERRY_PI.36 50.86,95.21 50.86,94.3 52.12,93.04 52.12,88.12 63.78,76.47 63.78,63.21 67.21,59.78 R_TASTER.2
TX_0_PIN_8
  Top 0.152: RASPBERRY_PI.8 17.83,97.84 67.55,97.84 68.81,96.58 UART_GROVE.2

### Text on the board
Top: MD | HoneyPi HAT 2.0 / https://www.honey-pi.de/
Bottom: HoneyPi HAT 2.0 / https://www.honey-pi.de/
tNames: 2 / 1 | 40 / / 39 | GND / / SCK / / DT / / 3V3 / / (SCK) / / (DT) / / (GND) | GND / / SCK / / DT / / 3V3 | GND / / SCK / / DT / / 3V3 / / (SCK) / / (DT) / / (GND) | GND / / 3v3 / / DT / / SCK | GND / / SCK / / DT / / 3V3 | GND / / SCK / / DT / / 3V3 | GND / / 3v3 / / DT / / SCK | GND / / 3v3 / / DT / / SCK | GND / / 3v3 / / DT / / SCK | GND / / / / / / 3v3 | GND / / 3v3 / / DT / / SCK | PIN3 / | LM 3v3 / PIN2 / | RPi 3v3 / PIN1 | Taster / / Taster / / LED + / / LED - | GPIO9 / | V GPIO / DS18B20 / | V Rpi / Rpi 3v3 | GND / / 3V3 / / / DATA | GND / / 3V3 / / / DATA | PIN3 / | LM 3v3 / PIN2 / | RPi 3v3 / PIN1 | SCL / / SDA / / 3V3 / / GND / / SDO | 3.3V / / GND / / SDA / / SCL | GND / / 3.3V / / SDA / / SCL | 5V | 5V / | W off / To Rpi / / / / / GND | + | - | V_PCF8591 / / GND | + | - | 7-16,5V 1A(max)